# Altium schematic sheet eBox_3G.SchDoc: eBox_3G
size A4; DocumentNumber: 4; SheetNumber: 4; SheetTotal: 7
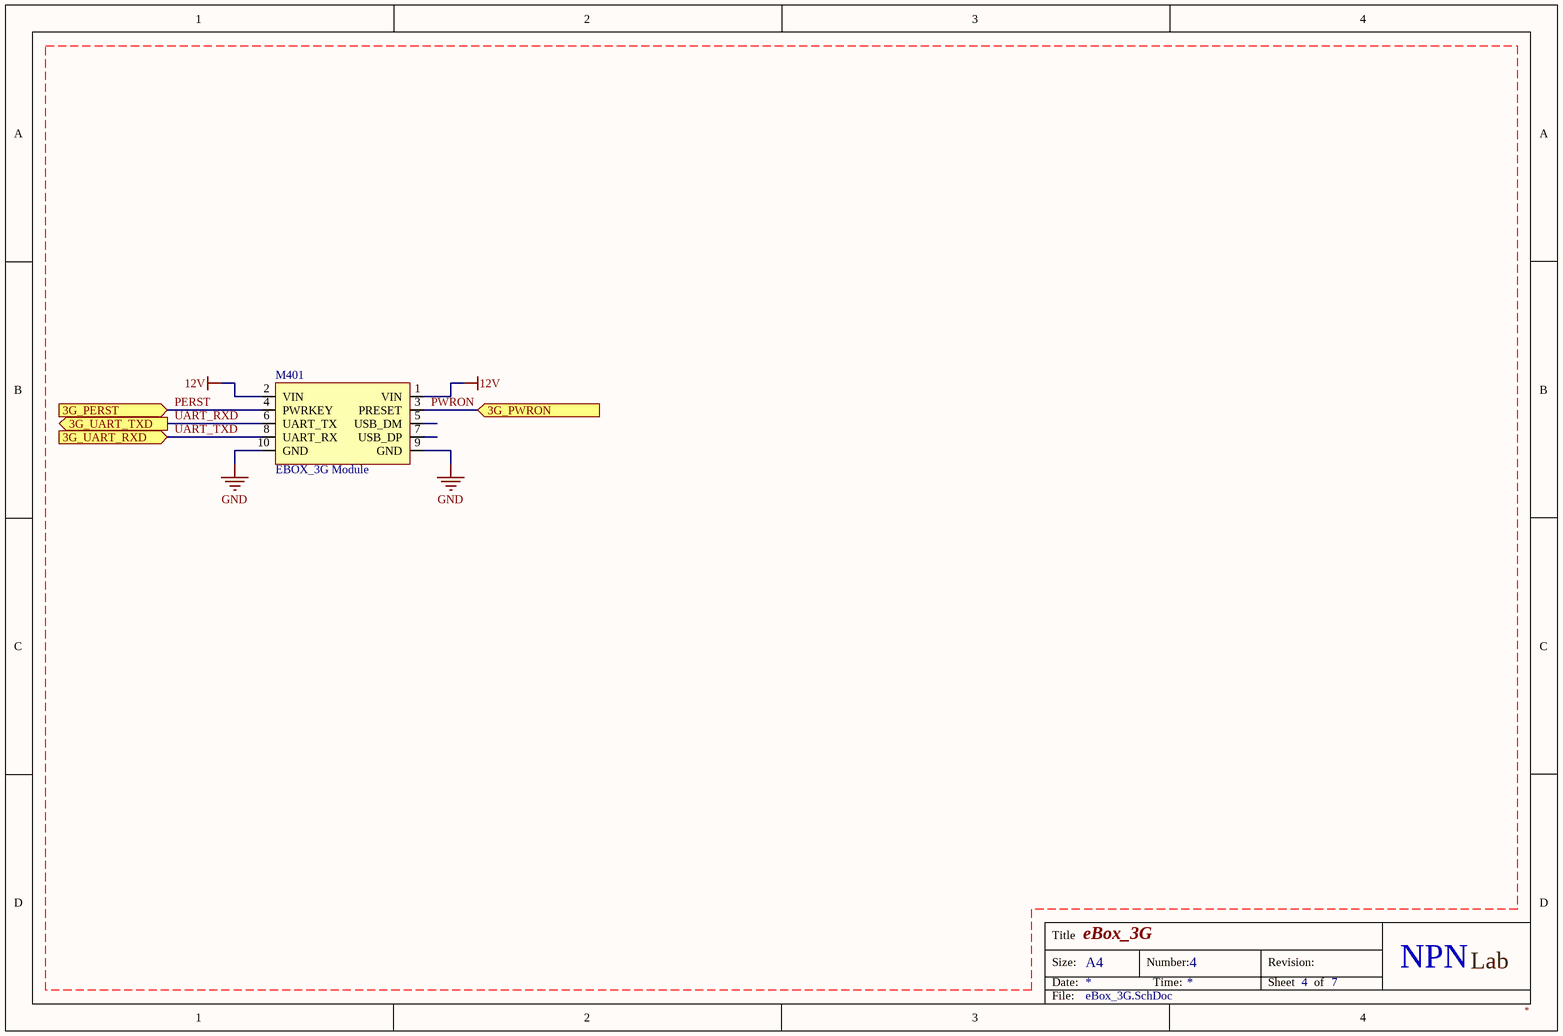
[diagram p0: eBox_3G.SchDoc]

## Parts
M401  EBOX_3G Module  [EBOX_3G]

## Ports
3G_PERST (in), 3G_PWRON (in), 3G_UART_RXD (in), 3G_UART_TXD (out)

## Nets
12V: M401.1(VIN) M401.2(VIN)
GND: M401.9(GND) M401.10(GND)
PERST: M401.4(PWRKEY) ; port 3G_PERST
PWRON: M401.3(PRESET) ; port 3G_PWRON
UART_RXD: M401.6(UART_TX) ; port 3G_UART_TXD
UART_TXD: M401.8(UART_RX) ; port 3G_UART_RXD

Not connected (* = marked no-connect by the designer): M401 5(USB_DM) 7(USB_DP)

## Notes on the sheet
- Title
- Size:
- Date:
- A4
- Number:
- Time:
- Revision:
- Sheet
- of
- NPN
- Lab
- File: